# Altium schematic sheet ATMEGA8精品开发板_参考.SchDoc
size A4
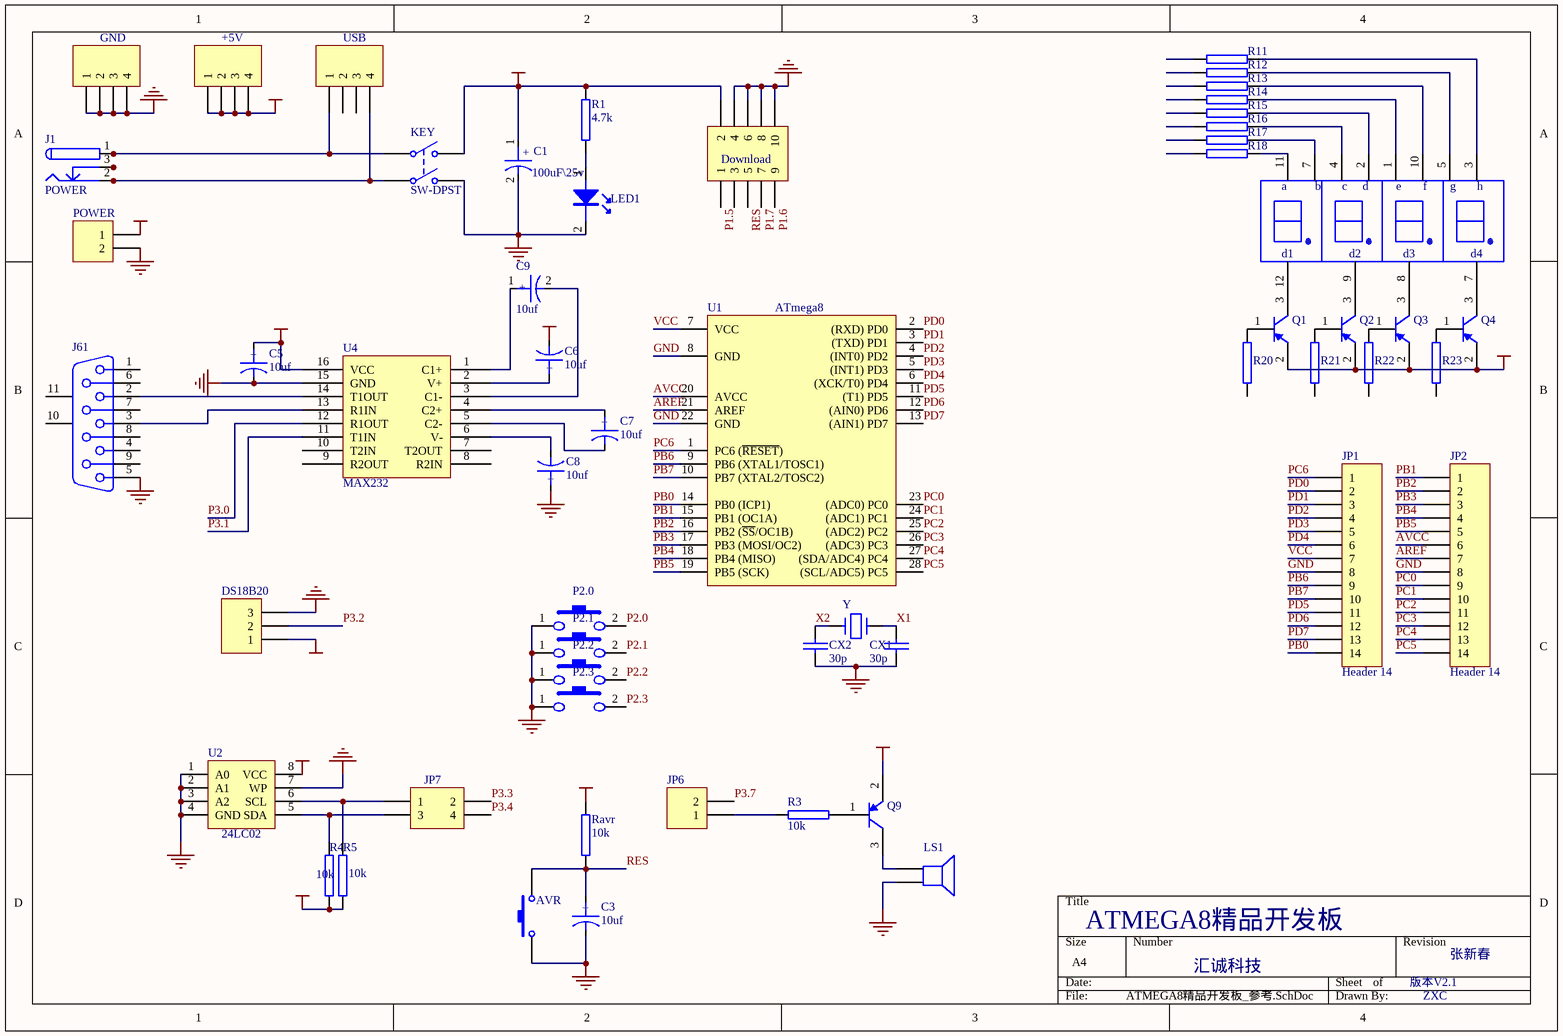
[diagram p0: ATMEGA8精品开发板_参考.SchDoc]

## Parts
11  LED8  [LED8PF]  (value not drawn)
+5V  (no value)  [HDR1X4]
?  Download  [HDR-2x5]
AVR  (no value)  [an-6*6]
C1  100uF\25v  [C-DJ-6]
C3  10uf  [C-DJ-4]
C5  10uf  [C-DJ-4]
C6  10uf  [C-DJ-4]
C7  10uf  [C-DJ-4]
C8  10uf  [C-DJ-4]
C9  10uf  [C-DJ-4]
CX1  30p  [HDR1X2]
CX2  30p  [HDR1X2]
DS18B20  (no value)  [HDR1X3]
GND  (no value)  [HDR1X4]
J1  POWER  [KLD-dy]
J61  D Connector 9  [DSUB1.385-2H9]  (value not drawn)
JP1  Header 14  [HDR1X14]
JP2  Header 14  [HDR1X14]
JP6  (no value)  [HDR1X2]
JP7  (no value)  [HDR2X2]
KEY  SW-DPST  [DPDT-6]
LED1  LED  [LED]  (value not drawn)
LS1  (no value)  [LS1PF]
P2.0  key1  [an-6*6]  (value not drawn)
P2.1  key2  [an-6*6]  (value not drawn)
P2.2  key3  [an-6*6]  (value not drawn)
P2.3  key4  [an-6*6]  (value not drawn)
POWER  (no value)  [JK128]
Q1  2N3906  [SO-G3]  (value not drawn)
Q2  2N3906  [SO-G3]  (value not drawn)
Q3  2N3906  [SO-G3]  (value not drawn)
Q4  2N3906  [SO-G3]  (value not drawn)
Q9  2N3906  [SO-G3]  (value not drawn)
R1  4.7k  [R2012-0805]
R3  10k  [R2012-0805]
R4  10k  [R2012-0805]
R5  10k  [R2012-0805]
R11  470  [R2012-0805]  (value not drawn)
R12  470  [R2012-0805]  (value not drawn)
R13  470  [R2012-0805]  (value not drawn)
R14  470  [R2012-0805]  (value not drawn)
R15  470  [R2012-0805]  (value not drawn)
R16  470  [R2012-0805]  (value not drawn)
R17  470  [R2012-0805]  (value not drawn)
R18  470  [R2012-0805]  (value not drawn)
R20  470  [R2012-0805]  (value not drawn)
R21  470  [R2012-0805]  (value not drawn)
R22  470  [R2012-0805]  (value not drawn)
R23  470  [R2012-0805]  (value not drawn)
Ravr  10k  [R2012-0805]
U1  ATmega8  [底座DIP-28/引脚7.62mm]
U2  24LC02  [DIP8]
U4  MAX232  [DIP16]
USB  (no value)  [USB-5V]
Y  Y  [11.0592M]

## Nets
GND: ?.4 ?.6 ?.8 ?.10 AVR.2 C1.2 C3.2 C5.2 C8.1 CX1.2 CX2.2 DS18B20.3 GND.1 GND.2 GND.3 GND.4 J61.5 JP1.8 JP2.8 KEY.4(NO2) LED1.2(K) LS1.2 P2.0.1 P2.1.1 P2.2.1 P2.3.1 POWER.2 U1.8(GND) U1.22(GND) U2.1(A0) U2.2(A1) U2.3(A2) U2.4(GND) U2.7(WP) U4.15(GND)
VCC: +5V.1 +5V.2 +5V.3 +5V.4 ?.2 C1.1 C5.1 C6.2 DS18B20.1 JP1.7 KEY.2(NO1) POWER.1 Q1.2(E) Q2.2(E) Q3.2(E) Q4.2(E) Q9.2(E) R1.1 R4.2 R5.2 Ravr.2 U1.7(VCC) U2.8(VCC) U4.16(VCC)
AREF: JP2.7 U1.21(AREF)
AVCC: JP2.6 U1.20(AVCC)
P1.5: ?.1
P1.6: ?.9
P1.7: ?.7
P2.0: P2.0.2
P2.1: P2.1.2
P2.2: P2.2.2
P2.3: P2.3.2
P3.0: U4.12(R1OUT)
P3.1: U4.11(T1IN)
P3.2: DS18B20.2
P3.3: JP7.2
P3.4: JP7.4
P3.7: JP6.2
PB0: JP1.14 U1.14(PB0_(ICP1))
PB1: JP2.1 U1.15(PB1_(OC1A))
PB2: JP2.2 U1.16(PB2_(~{SS}/OC1B))
PB3: JP2.3 U1.17(PB3_(MOSI/OC2))
PB4: JP2.4 U1.18(PB4_(MISO))
PB5: JP2.5 U1.19(PB5_(SCK))
PB6: JP1.9 U1.9(PB6_(XTAL1/TOSC1))
PB7: JP1.10 U1.10(PB7_(XTAL2/TOSC2))
PC0: JP2.9 U1.23((ADC0)_PC0)
PC1: JP2.10 U1.24((ADC1)_PC1)
PC2: JP2.11 U1.25((ADC2)_PC2)
PC3: JP2.12 U1.26((ADC3)_PC3)
PC4: JP2.13 U1.27((SDA/ADC4)_PC4)
PC5: JP2.14 U1.28((SCL/ADC5)_PC5)
PC6: JP1.1 U1.1(PC6_(~{RESET}))
PD0: JP1.2 U1.2((RXD)_PD0)
PD1: JP1.3 U1.3((TXD)_PD1)
PD2: JP1.4 U1.4((INT0)_PD2)
PD3: JP1.5 U1.5((INT1)_PD3)
PD4: JP1.6 U1.6((XCK/T0)_PD4)
PD5: JP1.11 U1.11((T1)_PD5)
PD6: JP1.12 U1.12((AIN0)_PD6)
PD7: JP1.13 U1.13((AIN1)_PD7)
RES: ?.5 AVR.1 C3.1 Ravr.1
X1: CX1.1 Y.1
X2: CX2.1 Y.2
Net11_1: 11.1 R14.2
Net11_2: 11.2 R15.2
Net11_3: 11.3 R11.2
Net11_4: 11.4 R16.2
Net11_5: 11.5 R12.2
Net11_7: 11.7 Q4.3(C)
Net11_7: 11.7 R17.2  [a separate net that carries the same name]
Net11_8: 11.8 Q3.3(C)
Net11_9: 11.9 Q2.3(C)
Net11_10: 11.10 R13.2
Net11_11: 11.11 R18.2
Net11_12: 11.12(d1) Q1.3(C)
NetC6_1: C6.1 U4.2(V+)
NetC7_1: C7.1 U4.4(C2+)
NetC7_2: C7.2 U4.5(C2-)
NetC8_2: C8.2 U4.6(V-)
NetC9_1: C9.1 U4.1(C1+)
NetC9_2: C9.2 U4.3(C1-)
NetJ1_1: J1.1 J1.1A J1.1B KEY.1(COMMON1) USB.1
NetJ1_2: J1.2 J1.2A J1.2B KEY.3(COMMON2) USB.4
NetJ1_3: J1.3 J1.3A J1.3B
NetJ61_2: J61.2 U4.14(T1OUT)
NetJ61_3: J61.3 U4.13(R1IN)
NetJP6_1: JP6.1 R3.1
NetJP7_1: JP7.1 R5.1 U2.6(SCL)
NetJP7_3: JP7.3 R4.1 U2.5(SDA)
NetLED1_1: LED1.1(A) R1.2
NetLS1_1: LS1.1 Q9.3(C)
NetQ1_1: Q1.1(B) R20.2
NetQ2_1: Q2.1(B) R21.2
NetQ3_1: Q3.1(B) R22.2
NetQ4_1: Q4.1(B) R23.2
NetQ9_1: Q9.1(B) R3.2

Not connected (* = marked no-connect by the designer): ? 3; J61 1 4 6 7 8 9 10(MH1) 11(MH2); R11 1; R12 1; R13 1; R14 1; R15 1; R16 1; R17 1; R18 1; R20 1; R21 1; R22 1; R23 1; U4 7(T2OUT) 8(R2IN) 9(R2OUT) 10(T2IN); USB 2 3

## Notes on the sheet
- ATMEGA8精品开发板
- 汇诚科技
- 版本V2.1
- 张新春
- ZXC
- (in symbol CAPACITOR POL) +
- (in symbol LED8) a; b; c; d; e; f; g; h; d2; d3; d4

## Library data of the parts
+5V GND USB = Header 4: Header, 4-Pin; Revision: 17-Jul-2002: Re-released for DXP Platform.; Publisher: Altium Limited
? = Header 5X2: Header, 5-Pin, Dual row; Revision: 17-Jul-2002: Re-released for DXP Platform.; Publisher: Altium Limited
AVR = SW-PB: Switch; Published: 24-Mar-1999; LatestRevisionDate: 17-Jul-2002; LatestRevisionNote: Re-released for DXP Platform.; Publisher: Altium Limited
C1 C3 C5-C9 = CAPACITOR POL: Capacitor
CX1 CX2 = CAP: Capacitor
DS18B20 = Header 3: Header, 3-Pin; LatestRevisionDate: 17-Jul-2002; LatestRevisionNote: Re-released for DXP Platform.; Publisher: Altium Limited
J1 = PWR2.5: Low Voltage Power Supply Connector; Published: 17-Dec-2003; DatasheetDocument: 09-May-2002; Publisher: Altium Limited
J61 = D Connector 9: Receptacle Assembly, 9 Position, Right Angle; Package Information: Latest Revision: O; Positions: 9; Published: 15-Jun-2001; Revision: 17-Jul-2002: Re-released for DXP Platform.; Datasheet: (1-Sep-1999); Package Reference: 788750; Publisher: Altium Limited; Orientation: Right Angle; Gender: Receptacle
JP1 JP2 = Header 14: Header, 14-Pin; LatestRevisionDate: 17-Jul-2002; LatestRevisionNote: Re-released for DXP Platform.; Publisher: Altium Limited
JP6 POWER = Header 2: Header, 2-Pin; LatestRevisionDate: 17-Jul-2002; LatestRevisionNote: Re-released for DXP Platform.; Publisher: Altium Limited
JP7 = Header 2X2: Header, 2-Pin, Dual row; LatestRevisionDate: 17-Jul-2002; LatestRevisionNote: Re-released for DXP Platform.; Publisher: Altium Limited
KEY = SW-DPST: Double-Pole, Single-Throw Switch; Published: 24-Mar-1999; Revision: July-2002: Re-released for DXP Platform.; Publisher: Altium Limited
LS1 = Speaker: Loudspeaker; Published: 24-Mar-1999; Revision: July-2002: Re-released for DXP Platform.; Publisher: Altium Limited
P2.0-P2.3 = key
Q1-Q4 Q9 = 2N3906: PNP General Purpose Amplifier; Revision 1: 11-Jul-2000: SIM Model Added.; Revision 2: 17-Jul-2002: Re-released for DXP Platform.; Revision 3: 15-Jan-2003: PCB Footprint 'BCY-W3/D4.7' replaced; Code - JEDEC: TO-92A; Published: 8-Jun-2000; Datasheet: Latest Revision: 1997; Package Reference: TO-92A; Publisher: Altium Limited
R1 R3-R5 R11-R18 R20-R23 Ravr = RES2
U1 = ATmega8-P: 8 位微处理器/28引脚; 子类别: 微处理器; 发布者: 磊元工作室; 发布日期: 2003年8月18日; 制造商: Atmel Corporation; 类别: 集成电路; 元件名称（国标）: 8 位微处理器; 元件名称（英文）: 8-bit Microcontroller; 特性:存储器容量: Flash：8KB ，EEPROM：512B ，RAM：1KB; 特性:定时器/计数器: 2 个 8-bit ，1 个 16-bit; 特性:模/数转换器: 6 通道 10-bit ADC; 特性:指令: 两个时钟周期的硬件乘法器
Y = CRYSTAL